# EAGLE schematic control_panel (EAGLE 9.6.2)
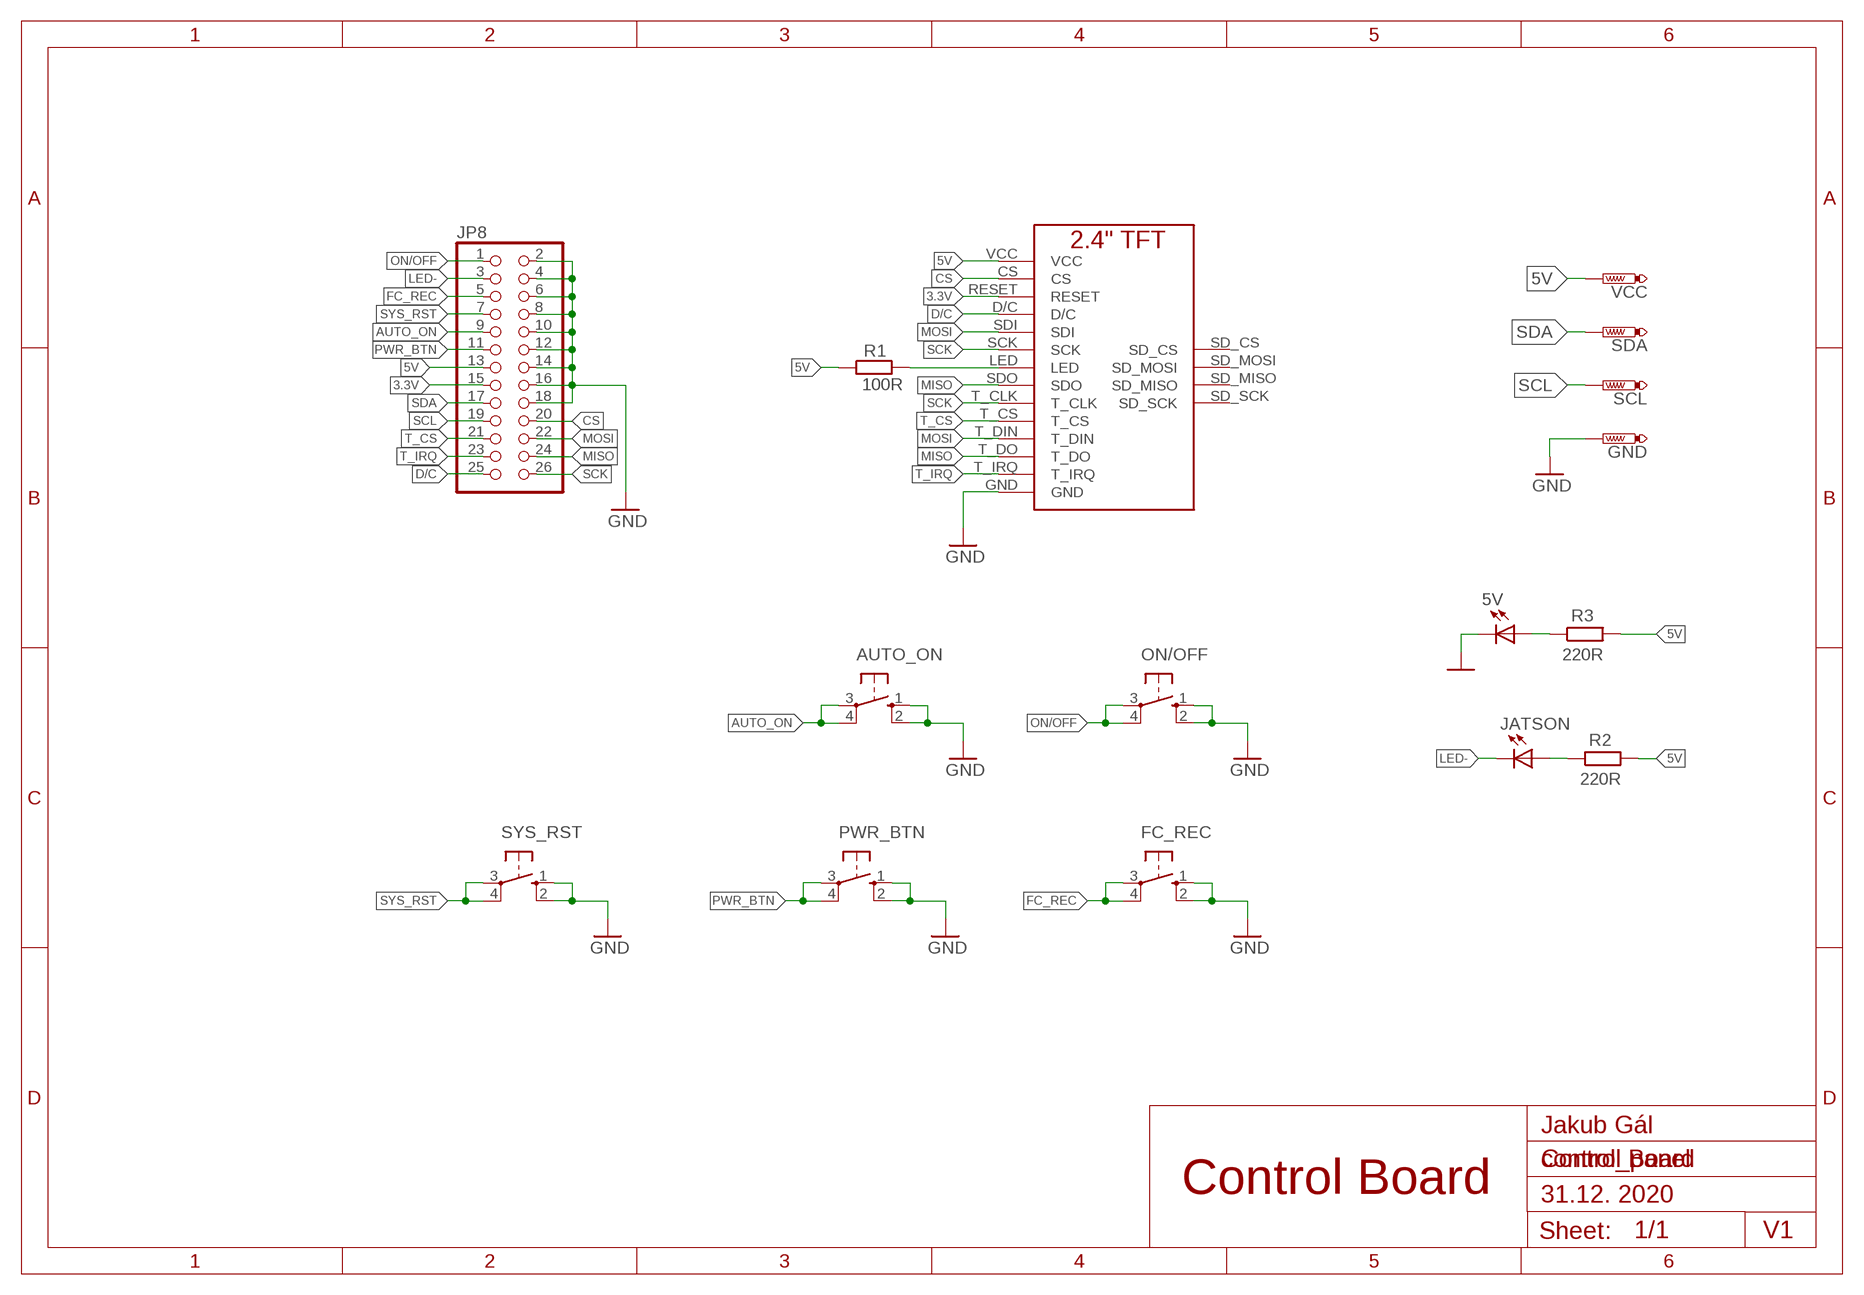
[diagram p0: schematic, sheet 1]

## Parts
5V  LEDCHIPLED_0603  [CHIPLED_0603]
AUTO_ON  10-XX  [B3F-10XX]
FC_REC  10-XX  [B3F-10XX]
GND  PTR1TP20R  [TP20R]
JATSON  LEDCHIPLED_0603  [CHIPLED_0603]
JP8  PINHD-2X13_2.54  [2X13]
ON/OFF  10-XX  [B3F-10XX]
PWR_BTN  10-XX  [B3F-10XX]
R1  100R  R-EU_R0603  [R0603]
R2  220R  R-EU_R0603  [R0603]
R3  220R  R-EU_R0603  [R0603]
SCL  PTR1TP20R  [TP20R]
SDA  PTR1TP20R  [TP20R]
SYS_RST  10-XX  [B3F-10XX]
U$1  2.4"TFT  [TFT_2.4"]
VCC  PTR1TP20R  [TP20R]

## Nets
3.3V: JP8.15 U$1.RESET
5V: JP8.13 R1.1 R2.2 R3.2 U$1.VCC VCC.TP
AUTO_ON: AUTO_ON.3(P) AUTO_ON.4(P1) JP8.9
CS: JP8.20 U$1.CS
D/C: JP8.25 U$1.D/C
FC_REC: FC_REC.3(P) FC_REC.4(P1) JP8.5
GND: 5V.C AUTO_ON.1(S) AUTO_ON.2(S1) FC_REC.1(S) FC_REC.2(S1) GND.TP JP8.2 JP8.4 JP8.6 JP8.8 JP8.10 JP8.12 JP8.14 JP8.16 JP8.18 ON/OFF.1(S) ON/OFF.2(S1) PWR_BTN.1(S) PWR_BTN.2(S1) SYS_RST.1(S) SYS_RST.2(S1) U$1.GND
LED-: JATSON.C JP8.3
MISO: JP8.24 U$1.SDO U$1.T_DO
MOSI: JP8.22 U$1.SDI U$1.T_DIN
N$1: R1.2 U$1.LED
N$2: JATSON.A R2.1
N$3: 5V.A R3.1
ON/OFF: JP8.1 ON/OFF.3(P) ON/OFF.4(P1)
PWR_BTN: JP8.11 PWR_BTN.3(P) PWR_BTN.4(P1)
SCK: JP8.26 U$1.SCK U$1.T_CLK
SCL: JP8.19 SCL.TP
SDA: JP8.17 SDA.TP
SYS_RST: JP8.7 SYS_RST.3(P) SYS_RST.4(P1)
T_CS: JP8.21 U$1.T_CS
T_IRQ: JP8.23 U$1.T_IRQ
Unconnected: U$1.SD_CS U$1.SD_MISO U$1.SD_MOSI U$1.SD_SCK

## Notes on the sheet
- Jakub Gál
- Control Board
- Control Board
- 31.12. 2020
- V1

## Library data of the parts
5V JATSON = audio amplifier example:LED
AUTO_ON FC_REC ON/OFF PWR_BTN SYS_RST = switch-omron:10-XX: OMRON SWITCH; MPN: B3F-1000; OC_FARNELL: 176432; OC_NEWARK: 36M3542
GND SCL SDA VCC = testpad:PTR1: TEST PIN
JP8 = pinhead-1:PINHD-2X13: PIN HEADER
R1-R3 = rcl:R-EU_: RESISTOR, European symbol; SPICEPREFIX: R
U$1 = TFT:2.4"TFT